# EAGLE design wireless_test (EAGLE 8.3.1)
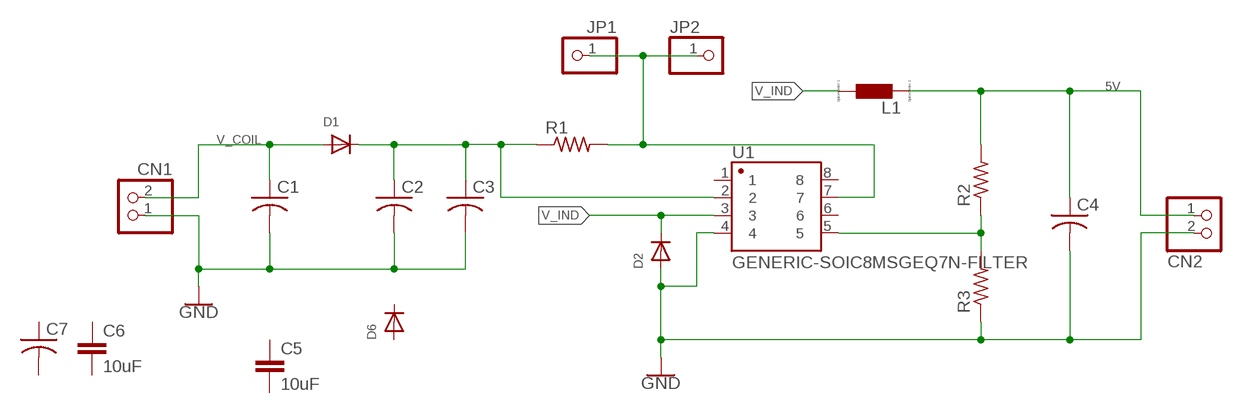
[diagram p0: schematic, sheet 1]

## Parts
C1  C-USC0805  [C0805]
C2  C-USC0805  [C0805]
C3  C-USC0805  [C0805]
C4  C-USC0805  [C0805]
C5  10uF  10UF-0805-10V-10%  [0805]
C6  10uF  10UF-1206-6.3V-20%  [1206]
C7  C-USC1206  [C1206]
CN1  JST_2PIN-THM-RA  [JST-PH-2-THM-RA]
CN2  JST_2PIN-THM-RA  [JST-PH-2-THM-RA]
D1  DIODESMA  [SMADIODE]
D2  DIODESOD-523  [SOD-523]
D6  DIODE_SOD-123FL  [SOD-123FL]
JP1  PINHD-1X1  [1X01]
JP2  PINHD-1X1  [1X01]
L1  LL3230M  [L3230M]
R1  R-US_R0603  [R0603]
R2  R-US_R0603  [R0603]
R3  R-US_R0603  [R0603]
U1  GENERIC-SOIC8MSGEQ7N-FILTER  [SO08]

## Nets
5V: C4.1 CN2.1 L1.2 R2.2
GND: C1.2 C2.2 C3.2 C4.2 CN1.1 CN2.2 D2.A R3.1 U1.4
N$1: R2.1 R3.2 U1.5
N$2: C2.1 C3.1 D1.C R1.1 U1.2
N$7: JP1.1 JP2.1 R1.2 U1.7
V_COIL: C1.1 CN1.2 D1.A
V_IND: D2.K(C) L1.1 U1.3
Unconnected: C5.1 C5.2 C6.1 C6.2 C7.1 C7.2 D6.A D6.C U1.1 U1.6 U1.8

## Library data of the parts
C1-C4 C7 = adafruit:C-US: CAPACITOR, American symbol
C5 = SparkFun-Capacitors:10UF: 10.0µF ceramic capacitors A capacitor is a passive two-terminal electrical component used to store electrical energy temporarily in an electric field.; PROD_ID: CAP-11330
C6 = SparkFun-Capacitors:10UF: 10.0µF ceramic capacitors A capacitor is a passive two-terminal electrical component used to store electrical energy temporarily in an electric field.; PROD_ID: CAP-10057
CN1 CN2 = adafruit:JST_2PIN: JST 2-Pin Connectors of various flavors SMT-RA (S2B-PH-SM4) 4UConnector #17311 SMT (B2B-PH-SM4) THM-RA (S2B-PH) THM (B2B-PH)
D1 D2 D6 = adafruit:DIODE: Diode SMADIODE - SMA Surface Mount Package 20V 1A Schottky Diode Digikey: 641-1014-6-ND DO-1N4148 - Through Hole Small Current Diode SOD-123 20V 1 A (.5mV Vf) Schottky Diode - Digikey: MBRX120TPMSCT-ND SOD-323 10V 570mA (.38mV Vf, 3ns) Schottky Diode - Digikey: ZLLS410CT-ND SOD-523 30V 30mA Schottky Diode (RB751S-40TE61) - Digikey: RB751S-40TE61CT-ND SOT23-R/W - SOT23 Package (R = Solder Paste/Reflow Ovens, W = Hand-Soldering) BAT54Film 40V 300mA - Digikey: 497-7162-1-ND
JP1 JP2 = pinhead:PINHD-1X1: PIN HEADER
L1 = eagle-ltspice:L: INDUCTOR, European symbol; SPICEMODEL: NONE; SPICEPREFIX: L
R1-R3 = adafruit:R-US_: RESISTOR, American symbol
U1 = SparkFun-Retired:GENERIC-SOIC8: A placeholder for generic narrow & wide SOIC8 foorptints - used on the DIP adapter board. Has strange reference to IC-10141, a Seven Band Graphic Equalizer Display Filter SOIC-8 VFP: IC-10141; PROD_ID: IC-10141

## Board
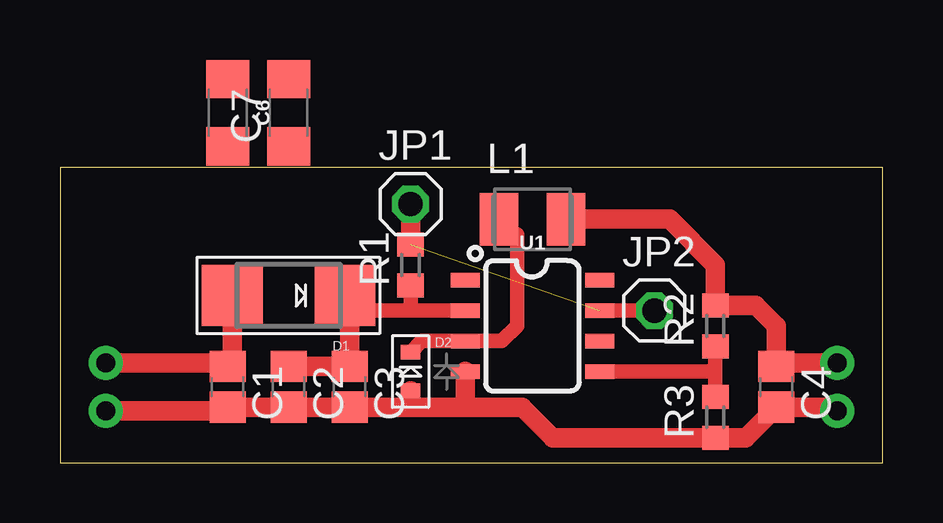
[diagram p1: board, top side]
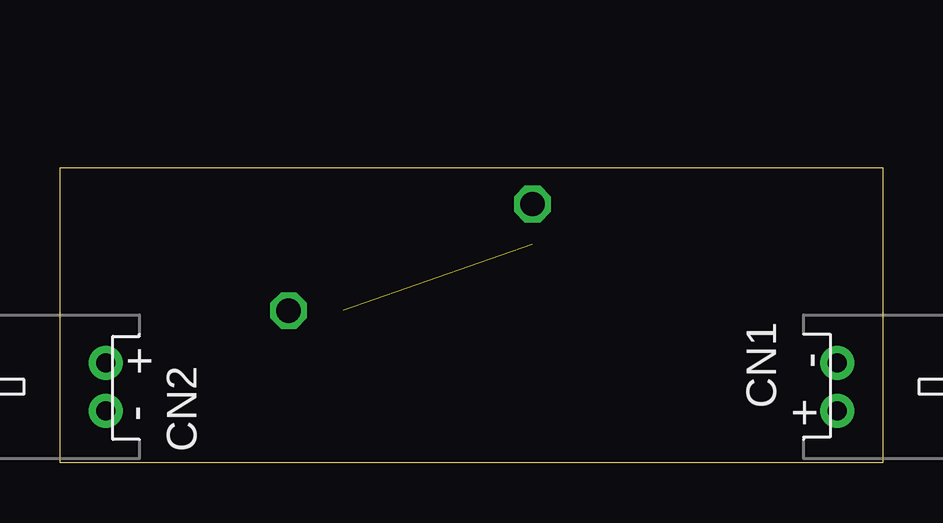
[diagram p2: board, bottom side, seen from below]

Size 34.29 x 12.32 mm. Coordinates in mm from the lower left corner, seen from the top.
Outline: 0,0 34.29,0 34.29,12.32 0,12.32 0,0
Copper layers (1*16): Top 0.035mm / dielectric 1.5mm / Bottom 0.035mm
Design rules "OthermillDRC_1_64_v2": minimum track width 16mil, minimum drill 31mil, track to track 0.39878125mm, track to pad 0.39878125mm, pad to pad 0.39878125mm, via to via 0.39878125mm, smd to smd 0mil, copper to edge 0mil, drill to drill 1mil, minimum pad ring 0mil, minimum via ring 15mil, stop-mask expansion 1mil, vias tented up to drill 30mil, thermal gap 10mil

### Footprints (pad centres in the part's own frame; a part is rotated, then mirrored left to right if it is on the bottom)
C0805 = smd 1.3 x 1.5: 1 -0.85,0; 2 0.85,0
0805 = smd 0.8 x 1.2: 1 -0.9,0; 2 0.9,0
1206 = smd 1.6 x 1.8: 1 -1.4,0; 2 1.4,0
C1206 = smd 1.6 x 1.8: 1 -1.4,0; 2 1.4,0
JST-PH-2-THM-RA = drill 0.8 pad 1.422: 1 1,0; 2 -1,0
SMADIODE = smd 2.54 x 2.54: A 2.349,0; C -2.349,0
SOD-523 = smd 0.8 x 0.6: A 0,-0.8; K 0,0.8
SOD-123FL = smd 0.91 x 1.22: A 1.637,0; C -1.637,0
1X01 = drill 1.016 octagon: 1 0,0
L3230M = smd 1.6 x 2.2: 1 -1.4,0; 2 1.4,0
R0603 = smd 1 x 1.1: 1 -0.85,0; 2 0.85,0
SO08 = smd 0.6 x 1.2: 1 -1.905,-2.8; 2 -0.635,-2.8; 3 0.635,-2.8; 4 1.905,-2.8; 5 1.905,2.8; 6 0.635,2.8; 7 -0.635,2.8; 8 -1.905,2.8

### Placement (x,y rotation side)
C1  6.99,3.17 270 top
C2  9.53,3.17 270 top
C3  12.06,3.17 270 top
C4  29.84,3.17 270 top
C5  -7.62,-5.08 270 top  (outside the outline)
C6  6.99,14.61 270 top
C7  9.53,14.61 90 top
CN1  1.91,3.17 270 bottom
CN2  32.38,3.17 90 bottom
D1  9.53,6.99 180 top
D2  14.61,3.81 0 top
D6  16.05,-5.65 270 top  (outside the outline)
JP1  14.61,10.79 0 top
JP2  24.77,6.35 0 top
L1  19.68,10.16 0 top
R1  14.61,8.26 90 top
R2  27.3,5.71 90 top
R3  27.3,1.91 90 top
U1  19.68,5.71 270 top

### Tracks (layer width: path | path; a pad name or v marks a point on that pad's centre or on a via)
5V
  Top 0.813: L1.2 25.4,10.16 27.3,8.26 R2.2 29,6.57 29.84,5.71 C4.1 30,4.17 CN2.1
GND
  Top 0.813: CN2.2 32.23,2.33 C4.2 28.57,1.05 R3.1 20.54,1.05 19.27,2.33 16.83,2.33 | 14.5,2.33 C3.2 C2.2 C1.2 6.83,2.17 CN1.1 | 16.83,2.33 14.5,2.33 | D2.A 14.61,2.43 14.5,2.33 | U1.4 16.89,2.38 16.83,2.33
N$1
  Top 0.61: 27.3,3.79 R2.1 | 27.3,3.79 R3.2 | 27.3,3.79 27.28,3.81 U1.5
N$2
  Top 0.61: D1.C 12.51,6.35 14.55,6.35 14.61,6.41 | 14.61,6.41 R1.1 | U1.2 14.66,6.35 14.61,6.41
  Top 0.813: C2.1 C3.1 12.06,6.79 D1.C
N$7  (1 unrouted)
  Top 0.61: U1.7 JP2.1
  Top 0.813: R1.2 JP1.1
V_COIL
  Top 0.61: 6.83,4.17 C1.1 | 6.83,6.64 D1.A
  Top 0.813: CN1.2 6.83,4.17 7.18,4.52 D1.A
V_IND
  Top 0.61: D2.K 15.07,5.08 U1.3 18.41,5.08 19.05,5.71 19.05,9.53 18.92,9.53 L1.1